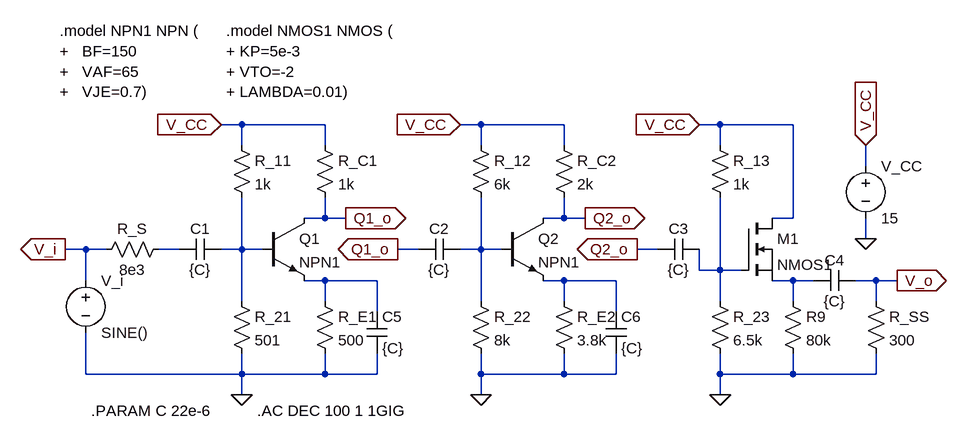
[diagram p0: schematic Amplifier Design.asc]
Amplifier Design.asc, the LTspice schematic file:
Version 4
SHEET 1 1468 680
WIRE 272 160 240 160
WIRE 400 160 272 160
WIRE 640 160 608 160
WIRE 768 160 640 160
WIRE 1008 160 976 160
WIRE 1120 160 1008 160
WIRE 272 192 272 160
WIRE 400 192 400 160
WIRE 640 192 640 160
WIRE 768 192 768 160
WIRE 1008 192 1008 160
WIRE 1232 224 1232 192
WIRE 400 304 400 272
WIRE 400 304 368 304
WIRE 432 304 400 304
WIRE 768 304 768 272
WIRE 768 304 736 304
WIRE 800 304 768 304
WIRE 1120 304 1120 160
WIRE 1120 304 1088 304
WIRE 1232 336 1232 304
WIRE 32 352 0 352
WIRE 64 352 32 352
WIRE 176 352 144 352
WIRE 272 352 272 272
WIRE 272 352 240 352
WIRE 304 352 272 352
WIRE 544 352 512 352
WIRE 640 352 640 272
WIRE 640 352 608 352
WIRE 672 352 640 352
WIRE 912 352 880 352
WIRE 976 384 976 352
WIRE 1008 384 1008 272
WIRE 1008 384 976 384
WIRE 1040 384 1008 384
WIRE 32 400 32 352
WIRE 400 400 368 400
WIRE 480 400 400 400
WIRE 768 400 736 400
WIRE 848 400 768 400
WIRE 1120 400 1088 400
WIRE 1152 400 1120 400
WIRE 1248 400 1216 400
WIRE 1280 400 1248 400
WIRE 272 432 272 352
WIRE 400 432 400 400
WIRE 640 432 640 352
WIRE 768 432 768 400
WIRE 1008 432 1008 384
WIRE 1120 432 1120 400
WIRE 1248 432 1248 400
WIRE 480 448 480 400
WIRE 848 448 848 400
WIRE 32 544 32 480
WIRE 272 544 272 512
WIRE 272 544 32 544
WIRE 400 544 400 512
WIRE 400 544 272 544
WIRE 480 544 480 512
WIRE 480 544 400 544
WIRE 640 544 640 512
WIRE 768 544 768 512
WIRE 768 544 640 544
WIRE 848 544 848 512
WIRE 848 544 768 544
WIRE 1008 544 1008 512
WIRE 1120 544 1120 512
WIRE 1120 544 1008 544
WIRE 1248 544 1248 512
WIRE 1248 544 1120 544
WIRE 272 576 272 544
WIRE 640 576 640 544
WIRE 1008 576 1008 544
FLAG 640 576 0
FLAG 1280 400 V_o
IOPIN 1280 400 Out
FLAG 240 160 V_CC
IOPIN 240 160 In
FLAG 1232 192 V_CC
IOPIN 1232 192 In
FLAG 1232 336 0
FLAG 0 352 V_i
IOPIN 0 352 Out
FLAG 272 576 0
FLAG 432 304 Q1_o
IOPIN 432 304 Out
FLAG 512 352 Q1_o
IOPIN 512 352 Out
FLAG 800 304 Q2_o
IOPIN 800 304 Out
FLAG 608 160 V_CC
IOPIN 608 160 In
FLAG 976 160 V_CC
IOPIN 976 160 In
FLAG 880 352 Q2_o
IOPIN 880 352 Out
FLAG 1008 576 0
SYMBOL npn 304 304 R0
SYMATTR InstName Q1
SYMATTR Value NPN1
SYMBOL npn 672 304 R0
SYMATTR InstName Q2
SYMATTR Value NPN1
SYMBOL nmos 1040 304 R0
SYMATTR InstName M1
SYMATTR Value NMOS1
SYMBOL Res 384 176 R0
SYMATTR InstName R_C1
SYMATTR Value 1k
SYMBOL Res 384 416 R0
SYMATTR InstName R_E1
SYMATTR Value 500
SYMBOL Res 752 416 R0
SYMATTR InstName R_E2
SYMATTR Value 3.8k
SYMBOL Res 992 176 R0
SYMATTR InstName R_13
SYMATTR Value 1k
SYMBOL Res 752 176 R0
SYMATTR InstName R_C2
SYMATTR Value 2k
SYMBOL Res 624 416 R0
SYMATTR InstName R_22
SYMATTR Value 8k
SYMBOL Res 256 416 R0
SYMATTR InstName R_21
SYMATTR Value 501
SYMBOL Res 256 176 R0
SYMATTR InstName R_11
SYMATTR Value 1k
SYMBOL Res 1104 416 R0
SYMATTR InstName R9
SYMATTR Value 80k
SYMBOL Res 992 416 R0
SYMATTR InstName R_23
SYMATTR Value 6.5k
SYMBOL Res 1232 416 R0
SYMATTR InstName R_SS
SYMATTR Value 300
SYMBOL Res 160 336 R90
WINDOW 0 0 56 VBottom 2
WINDOW 3 32 56 VTop 2
SYMATTR InstName R_S
SYMATTR Value 8e3
SYMBOL Cap 240 336 R90
WINDOW 0 0 32 VBottom 2
WINDOW 3 32 32 VTop 2
SYMATTR InstName C1
SYMATTR Value {C}
SYMBOL Cap 608 336 R90
WINDOW 0 0 32 VBottom 2
WINDOW 3 32 32 VTop 2
SYMATTR InstName C2
SYMATTR Value {C}
SYMBOL Cap 976 336 R90
WINDOW 0 0 32 VBottom 2
WINDOW 3 32 32 VTop 2
SYMATTR InstName C3
SYMATTR Value {C}
SYMBOL Cap 1216 384 R90
WINDOW 0 0 32 VBottom 2
WINDOW 3 32 32 VTop 2
SYMATTR InstName C4
SYMATTR Value {C}
SYMBOL Res 624 176 R0
SYMATTR InstName R_12
SYMATTR Value 6k
SYMBOL Voltage 32 384 R0
SYMATTR InstName V_i
SYMATTR Value SINE()
SYMATTR Value2 AC 1
SYMBOL Voltage 1232 208 R0
SYMATTR InstName V_CC
SYMATTR Value 15
SYMBOL Cap 464 448 R0
SYMATTR InstName C5
SYMATTR Value {C}
SYMBOL Cap 832 448 R0
SYMATTR InstName C6
SYMATTR Value {C}
TEXT 40 600 Left 2 !.PARAM C 22e-6
TEXT 296 600 Left 2 !.AC DEC 100 1 1GIG
TEXT -8 16 Left 2 !.model NPN1 NPN (\n+   BF=150\n+   VAF=65\n+   VJE=0.7)
TEXT 248 16 Left 2 !.model NMOS1 NMOS (\n+ KP=5e-3\n+ VTO=-2\n+ LAMBDA=0.01)

The netlist it stands for:
* Amplifier Design.asc
Q1 Q1_o N002 N005 0 NPN1
Q2 Q2_o N003 N006 0 NPN1
M1 V_CC N004 N007 N007 NMOS1
R_C1 V_CC Q1_o 1k
R_E1 N005 0 500
R_E2 N006 0 3.8k
R_13 V_CC N004 1k
R_C2 V_CC Q2_o 2k
R_22 N003 0 8k
R_21 N002 0 501
R_11 V_CC N002 1k
R9 N007 0 80k
R_23 N004 0 6.5k
R_SS V_o 0 300
R_S N001 V_i 8e3
C1 N002 N001 {C}
C2 N003 Q1_o {C}
C3 N004 Q2_o {C}
C4 V_o N007 {C}
R_12 V_CC N003 6k
V_i V_i 0 SINE() AC 1
V_CC V_CC 0 15
C5 N005 0 {C}
C6 N006 0 {C}
.model NPN NPN
.model PNP PNP
.lib standard.bjt
.model NMOS NMOS
.model PMOS PMOS
.lib standard.mos
.PARAM C 22e-6
.AC DEC 100 1 1GIG
.model NPN1 NPN (
+   BF=150
+   VAF=65
+   VJE=0.7)
.model NMOS1 NMOS (
+ KP=5e-3
+ VTO=-2
+ LAMBDA=0.01)
.backanno
.end